# Altium project lab03.PrjPcb
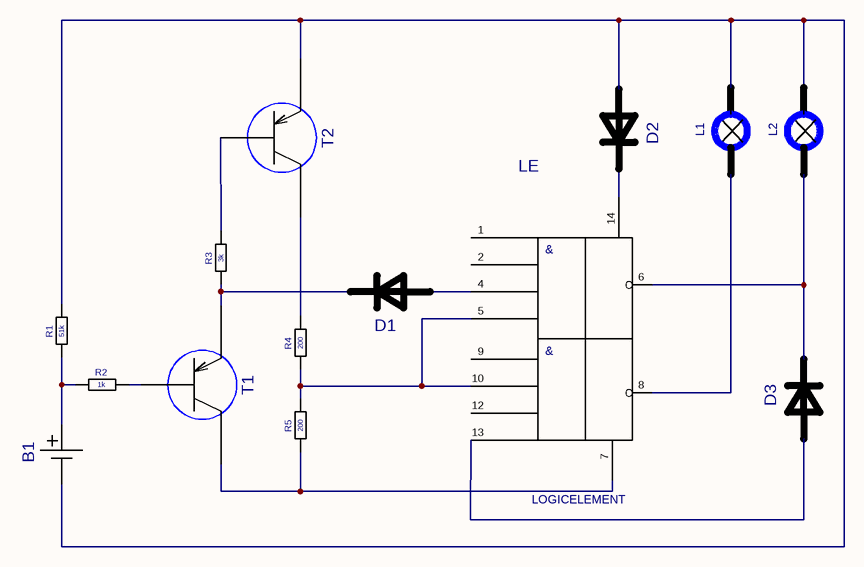
[diagram p0: Sheet1.SCHDOC]
1 sheet, 14 parts. Net scope: global (net labels, ports and power ports of the same name join across sheets).

## Sheet Sheet1.SCHDOC
size 279 x 215 mm; SheetNumber: 1; SheetTotal: 1; DocumentName: Sheet1.SCHDOC

### Parts
B1  KRONA  [KRONA]  (value not drawn)
D1  DIODE  [DIODE]  (value not drawn)
D2  DIODE  [DIODE]  (value not drawn)
D3  DIODE  [DIODE]  (value not drawn)
L1  СМН6.3-20-2  [HL_MINI]  (value not drawn)
L2  СМН6.3-20-2  [HL_MINI]  (value not drawn)
LE  LOGICELEMENT  [LOGICELEMENT]
R1  value 51k  [RES]  (hidden comment: RES)
R2  value 1k  [RES]  (hidden comment: RES)
R3  value 3k  [RES]  (hidden comment: RES)
R4  value 200  [RES]  (hidden comment: RES)
R5  value 200  [RES]  (hidden comment: RES)
T1  PNP  [KT-27 (2002)]  (value not drawn)
T2  PNP  [KT-27 (2002)]  (value not drawn)

### Nets
NetB1_minus: B1.minus D2.1 L1.2 L2.2 R1.1 T2.1
NetB1_plus: B1.plus R1.2 R2.2
NetD1_1: D1.1 LE.4
NetD1_2: D1.2 R3.2 T1.1
NetD2_2: D2.2 LE.14
NetD3_1: D3.1 LE.13
NetD3_2: D3.2 L2.1 LE.6
NetL1_1: L1.1 LE.8
NetLE_5: LE.5 LE.10 R4.2 R5.1
NetLE_7: LE.7 R5.2 T1.3
NetR2_1: R2.1 T1.2
NetR3_1: R3.1 T2.2
NetR4_1: R4.1 T2.3

Not connected (* = marked no-connect by the designer): B1 1 2; LE 1(0) 2(0) 9(0) 12(0)

### Notes on the sheet
- (in symbol LOGICELEMENT) &

### Library data of the parts
R1-R5 = RES: Resistor; ComponentField6: Published 8-Jun-2000; OriginalName: RES
B1 = KRONA: Value: *; Author: pcbdesigner.ru
D1-D3 = DIODE: Value: *
LE = LOGICELEMENT: Value: *
T1 T2 = PNP: Value: *